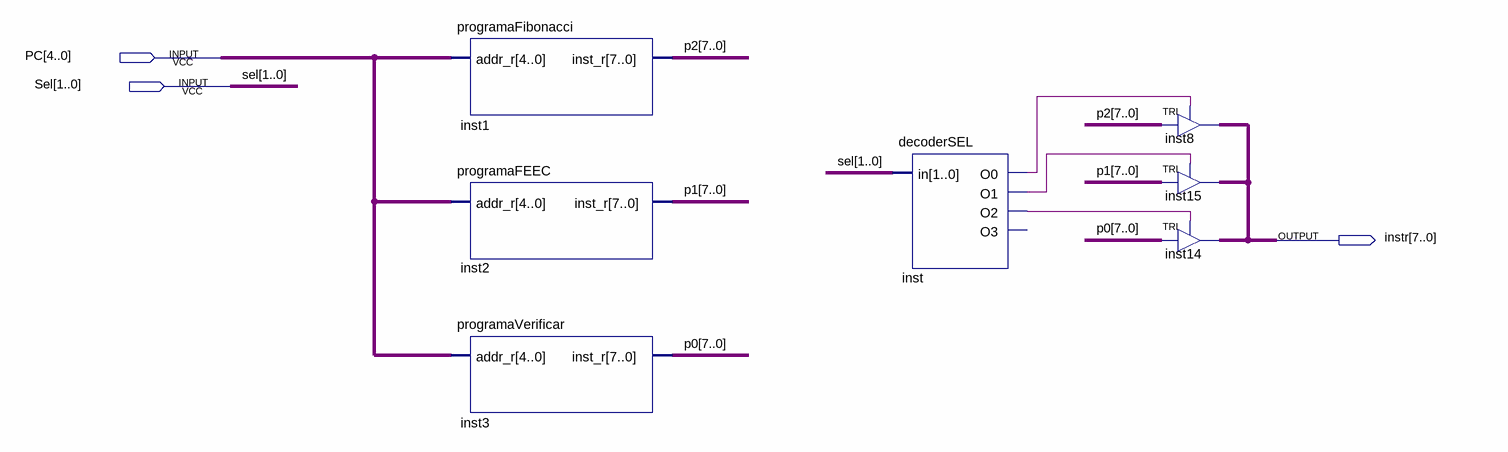
[diagram p0: schematic sheet]
// Quartus schematic bancoROM.bdf as structural Verilog: 7 symbols, 3 pins
module bancoROM (
  input  [4:0] PC,
  input  [1:0] Sel,
  output [7:0] instr
);

  wire inst_o0, inst_o1, inst_o2;
  wire [7:0] p0, p1, p2;

  programaFibonacci inst1 (.addr_r(PC), .inst_r(p2));
  programaFEEC inst2 (.addr_r(PC), .inst_r(p1));
  programaVerificar inst3 (.addr_r(PC), .inst_r(p0));
  decoderSEL inst (.in(Sel), .O0(inst_o0), .O1(inst_o1), .O2(inst_o2));  // open: O3
  TRI inst8[7:0] (.IN(p2), .OE(inst_o0), .OUT(instr));
  TRI inst15[7:0] (.IN(p1), .OE(inst_o1), .OUT(instr));
  TRI inst14[7:0] (.IN(p0), .OE(inst_o2), .OUT(instr));
endmodule
